# Altium schematic sheet LCD.SchDoc
size 420 x 297 mm; Address1: Address1; Address2: Address2; Address3: Address3; Address4: Address4; DocumentNumber: LCD Control FRONT 7"; SheetNumber: 1; SheetTotal: 6; Scale: 1:1; DocumentType: Схема электрическая принципиальная; FirstReferrence: АБВГ.123456.001
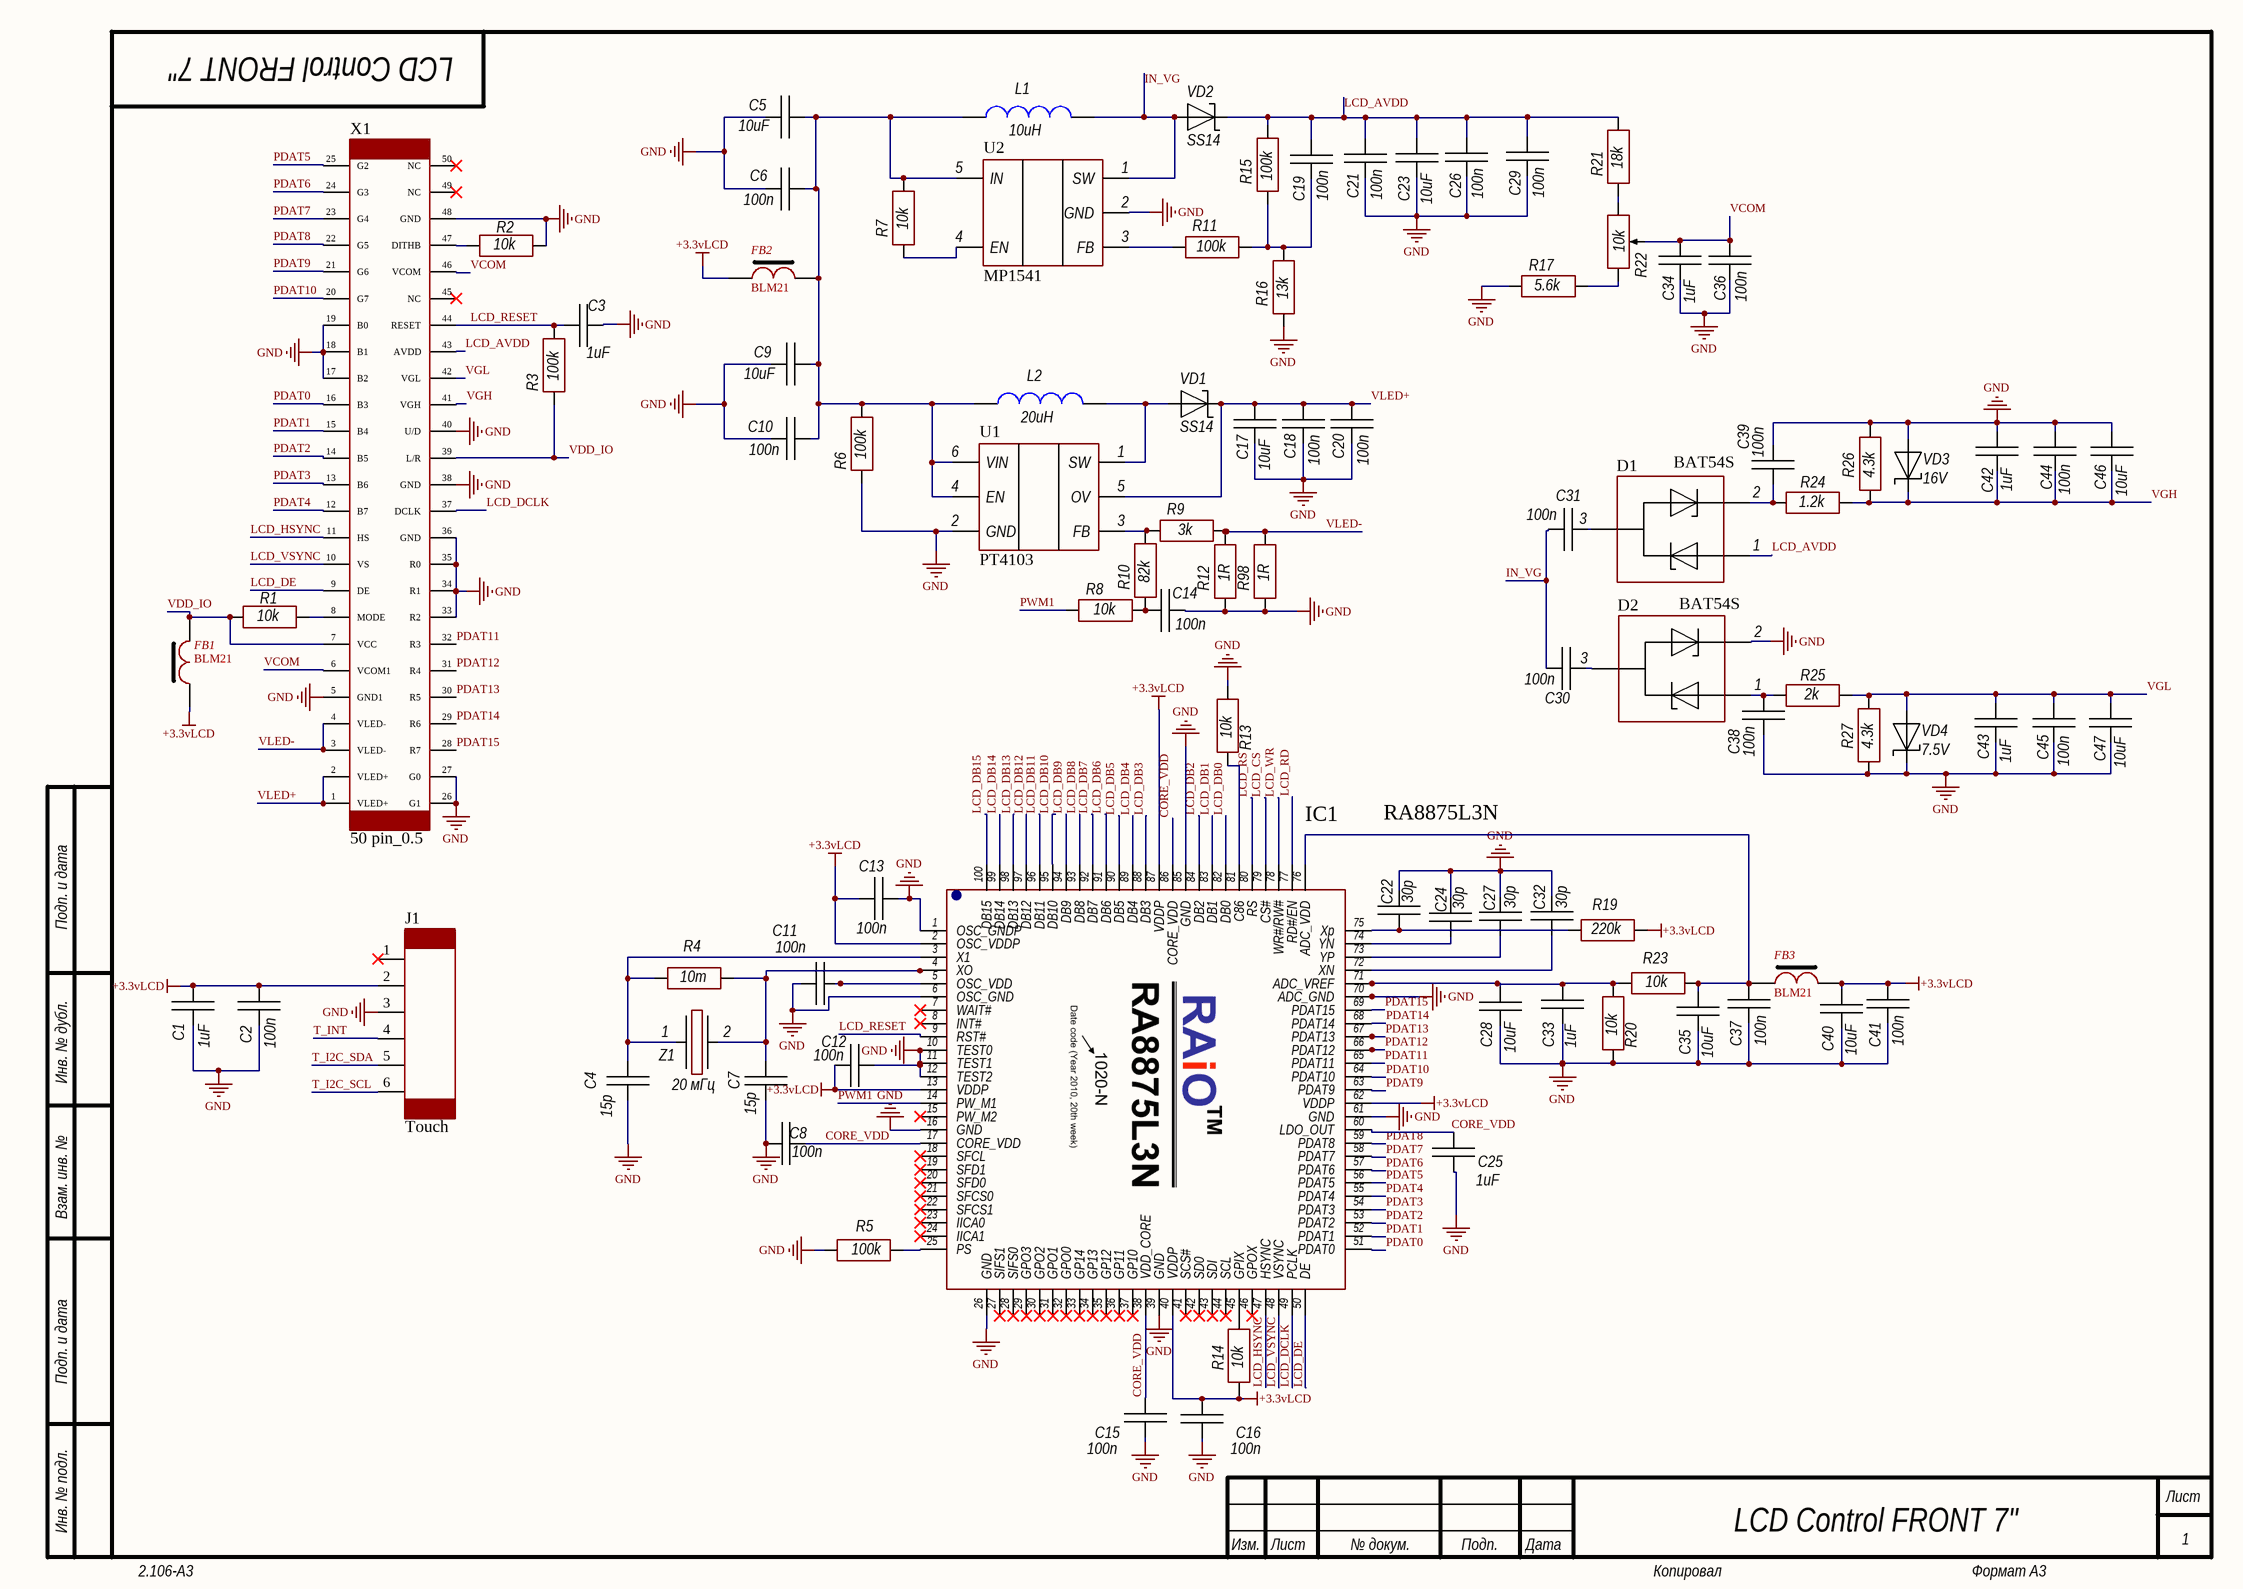
[diagram p0: LCD.SchDoc]

## Parts
C1  1uF  [CH0805C]
C2  100n  [CH0805C]
C3  1uF  [CH0603C]
C4  15p  [CH0603C]
C5  10uF  [CH1206C]
C6  100n  [CH0603C]
C7  15p  [CH0603C]
C8  100n  [CH0603C]
C9  10uF  [CH1206C]
C10  100n  [CH0603C]
C11  100n  [CH0603C]
C12  100n  [CH0603C]
C13  100n  [CH0603C]
C14  100n  [CH0603C]
C15  100n  [CH0603C]
C16  100n  [CH0603C]
C17  10uF  [CH1206C]
C18  100n  [CH0603C]
C19  100n  [CH0603C]
C20  100n  [CH0603C]
C21  100n  [CH0603C]
C22  30p  [CH0603C]
C23  10uF  [CH1206C]
C24  30p  [CH0603C]
C25  1uF  [CH0603C]
C26  100n  [CH0603C]
C27  30p  [CH0603C]
C28  10uF  [CH1206C]
C29  100n  [CH0603C]
C30  100n  [CH0603C]
C31  100n  [CH0603C]
C32  30p  [CH0603C]
C33  1uF  [CH0603C]
C34  1uF  [CH1206C]
C35  10uF  [CH1206C]
C36  100n  [CH0603C]
C37  100n  [CH0603C]
C38  100n  [CH0603C]
C39  100n  [CH0603C]
C40  10uF  [CH1206C]
C41  100n  [CH0603C]
C42  1uF  [CH0603C]
C43  1uF  [CH0603C]
C44  100n  [CH0603C]
C45  100n  [CH0603C]
C46  10uF  [CH1206C]
C47  10uF  [CH1206C]
D1  BAT54S  [SOT23_132]
D2  BAT54S  [SOT23_132]
FB1  BLM21  [CH0805L]
FB2  BLM21  [CH0805L]
FB3  BLM21  [CH0805L]
IC1  RA8875L3N  [100-LQFP]
J1  Touch  [FFC-6PIN]
L1  10uH  [IND: SDR0403]
L2  20uH  [IND: SDR0403]
R1  10k  [CH0603R]
R2  10k  [CH0603R]
R3  100k  [CH0603R]
R4  10m  [CH0603R]
R5  100k  [CH0603R]
R6  100k  [CH0603R]
R7  10k  [CH0603R]
R8  10k  [CH0603R]
R9  3k  [CH0603R]
R10  82k  [CH0603R]
R11  100k  [CH0603R]
R12  1R  [CH0603R]
R13  10k  [CH0603R]
R14  10k  [CH0603R]
R15  100k  [CH0603R]
R16  13k  [CH0603R]
R17  5.6k  [CH0603R]
R19  220k  [CH0603R]
R20  10k  [CH0603R]
R21  18k  [CH0603R]
R22  10k  [RES: 3314G]
R23  10k  [CH0603R]
R24  1.2k  [CH0603R]
R25  2k  [CH0603R]
R26  4.3k  [CH0603R]
R27  4.3k  [CH0603R]
R98  1R  [CH0603R]
U1  PT4103  [SOT23-6-ASM]
U2  MP1541  [SOT23-5]
VD1  SS14  [SMA]
VD2  SS14  [SMA]
VD3  16V  [SOD123]
VD4  7.5V  [SOD123]
X1  50 pin_0.5  [FFC FPC 50]
Z1  20 мГц  [OSC: Hz]

## Nets
+3.3vLCD: C1.2 C2.2 C12.1 C13.1 C16.2 C40.2 C41.2 FB1.2 FB2.2 FB3.1 IC1.2(OSC_VDDP) IC1.13(VDDP) IC1.40(VDDP) IC1.62(VDDP) IC1.87(VDDP) J1.2(B0) R14.1 R19.2
GND: C1.1 C2.1 C3.2 C4.1 C5.1 C6.1 C7.1 C8.1 C9.1 C10.1 C11.1 C12.2 C13.2 C14.2 C15.1 C16.1 C17.1 C18.1 C20.1 C21.1 C22.2 C23.1 C24.2 C25.1 C26.1 C27.2 C28.1 C29.1 C32.2 C33.1 C34.1 C35.1 C36.1 C37.1 C38.1 C39.2 C40.1 C41.1 C42.2 C43.1 C44.2 C45.1 C46.2 C47.1 D2.2 IC1.1(OSC_GNDP) IC1.6(OSC_GND) IC1.10(TEST0) IC1.11(TEST1) IC1.12(TEST2) IC1.16(GND) IC1.26(GND) IC1.39(GND) IC1.61(GND) IC1.70(ADC_GND) IC1.85(GND) J1.3(B1) R2.2 R5.1 R6.1 R12.1 R13.2 R16.1 R17.1 R20.1 R26.2 R27.1 R98.1 U1.2(GND) U2.2(GND) VD3.1 VD4.2 X1.5(GND1) X1.17(B2) X1.18(B1) X1.19(B0) X1.26(G1) X1.27(G0) X1.33(R2) X1.34(R1) X1.35(R0) X1.36(GND) X1.38(GND) X1.40(U/D) X1.48(GND)
CORE_VDD: C8.2 C15.2 C25.2 IC1.17(CORE_VDD) IC1.38(VDD_CORE) IC1.60(LDO_OUT) IC1.86(CORE_VDD)
IN_VG: C30.1 C31.1 L1.1 U2.1(SW) VD2.1
LCD_AVDD: C19.2 C21.2 C23.2 C26.2 C29.2 D1.1 R15.2 R21.2 VD2.2 X1.43(AVDD)
LCD_CS: IC1.79(CS#)
LCD_DB0: IC1.82(DB0)
LCD_DB1: IC1.83(DB1)
LCD_DB2: IC1.84(DB2)
LCD_DB3: IC1.88(DB3)
LCD_DB4: IC1.89(DB4)
LCD_DB5: IC1.90(DB5)
LCD_DB6: IC1.91(DB6)
LCD_DB7: IC1.92(DB7)
LCD_DB8: IC1.93(DB8)
LCD_DB9: IC1.94(DB9)
LCD_DB10: IC1.95(DB10)
LCD_DB11: IC1.96(DB11)
LCD_DB12: IC1.97(DB12)
LCD_DB13: IC1.98(DB13)
LCD_DB14: IC1.99(DB14)
LCD_DB15: IC1.100(DB15)
LCD_DCLK: IC1.49(PCLK) X1.37(DCLK)
LCD_DE: IC1.50(DE) X1.9(DE)
LCD_HSYNC: IC1.47(HSYNC) X1.11(HS)
LCD_RD: IC1.77(RD#/EN)
LCD_RESET: C3.1 IC1.9(RST#) R3.2 X1.44(RESET)
LCD_RS: IC1.80(RS)
LCD_VSYNC: IC1.48(VSYNC) X1.10(VS)
LCD_WR: IC1.78(WR#/RW#)
PDAT0: IC1.51(PDAT0) X1.16(B3)
PDAT1: IC1.52(PDAT1) X1.15(B4)
PDAT2: IC1.53(PDAT2) X1.14(B5)
PDAT3: IC1.54(PDAT3) X1.13(B6)
PDAT4: IC1.55(PDAT4) X1.12(B7)
PDAT5: IC1.56(PDAT5) X1.25(G2)
PDAT6: IC1.57(PDAT6) X1.24(G3)
PDAT7: IC1.58(PDAT7) X1.23(G4)
PDAT8: IC1.59(PDAT8) X1.22(G5)
PDAT9: IC1.63(PDAT9) X1.21(G6)
PDAT10: IC1.64(PDAT10) X1.20(G7)
PDAT11: IC1.65(PDAT11) X1.32(R3)
PDAT12: IC1.66(PDAT12) X1.31(R4)
PDAT13: IC1.67(PDAT13) X1.30(R5)
PDAT14: IC1.68(PDAT14) X1.29(R6)
PDAT15: IC1.69(PDAT15) X1.28(R7)
PWM1: IC1.14(PW_M1) R8.1
T_I2C_SCL: J1.6(B4)
T_I2C_SDA: J1.5(B3)
T_INT: J1.4(B2)
VCOM: C34.2 C36.2 R22.2 X1.6(VCOM1) X1.46(VCOM)
VDD_IO: FB1.1 R1.1 R3.1 X1.7(VCC) X1.39(L/R)
VGH: C42.1 C44.1 C46.1 R24.2 R26.1 VD3.2 X1.41(VGH)
VGL: C43.2 C45.2 C47.2 R25.2 R27.2 VD4.1 X1.42(VGL)
VLED+: C17.2 C18.2 C20.2 U1.5(OV) VD1.2 X1.1(VLED+) X1.2(VLED+)
VLED-: R9.2 R12.2 R98.2 X1.3(VLED-) X1.4(VLED-)
NetC4_2: C4.2 IC1.3(X1) R4.1 Z1.1
NetC5_2: C5.2 C6.2 C9.2 C10.2 FB2.1 L1.2 L2.2 R6.2 R7.2 U1.4(EN) U1.6(VIN) U2.5(IN)
NetC7_2: C7.2 IC1.4(XO) R4.2 Z1.2
NetC11_2: C11.2 IC1.5(OSC_VDD)
NetC14_1: C14.1 R8.2 R10.1
NetC19_1: C19.1 R11.2 R15.1 R16.2
NetC22_1: C22.1 IC1.75(Xp) R19.1
NetC24_1: C24.1 IC1.74(YN)
NetC27_1: C27.1 IC1.73(YP)
NetC28_2: C28.2 C33.2 IC1.71(ADC_VREF) R20.2 R23.1
NetC30_2: C30.2 D2.3
NetC31_2: C31.2 D1.3
NetC32_1: C32.1 IC1.72(XN)
NetC35_2: C35.2 C37.2 FB3.2 IC1.76(ADC_VDD) R23.2
NetC38_2: C38.2 D2.1 R25.1
NetC39_1: C39.1 D1.2 R24.1
NetIC1_25: IC1.25(PS) R5.2
NetIC1_45: IC1.45(GPIX) R14.2
NetIC1_81: IC1.81(C86) R13.1
NetL2_1: L2.1 U1.1(SW) VD1.1
NetR1_2: R1.2 X1.8(MODE)
NetR2_1: R2.1 X1.47(DITHB)
NetR7_1: R7.1 U2.4(EN)
NetR9_1: R9.1 R10.2 U1.3(FB)
NetR11_1: R11.1 U2.3(FB)
NetR17_2: R17.2 R22.3
NetR21_1: R21.1 R22.1

Not connected (* = marked no-connect by the designer): IC1 7(WAIT#)* 8(INT#)* 15(PW_M2)* 18(SFCL)* 19(SFD1)* 20(SFD0)* 21(SFCS0)* 22(SFCS1)* 23(IICA0)* 24(IICA1)* 27(SIFS1)* 28(SIFS0)* 29(GPO3)* 30(GPO2)* 31(GPO1)* 32(GPO0)* 33(GP14)* 34(GP13)* 35(GP12)* 36(GP11)* 37(GP10)* 41(SCS#)* 42(SD0)* 43(SDI)* 44(SCL)* 46(GPOX)*; J1 1(G7)*; X1 45(NC)* 49(NC)* 50(NC)*

## Notes on the sheet
- Подп. и дата
- Инв. № дубл.
- Взам. инв. №
- Инв. № подл.
- Изм.
- Лист
- № докум.
- Подп.
- Дата
- 2.106-A3
- Копировал
- Формат А3
- (in symbol RA8875) .

## Library data of the parts
C1-C47 = Capacitor: Manufacturer: *; Model: *; HelpURL: *; ComponentKind: *; Value: *
D1 D2 = BAT54
FB1-FB3 = FB-1
IC1 = RA8875
J1 = 6-Conn
L1 L2 = Inductor: Manufacturer: *; Model: *; HelpURL: *; ComponentKind: *; Value: *
R1-R17 R19-R21 R23-R27 R98 = Resistor: Manufacturer: *; Model: *; HelpURL: *; ComponentKind: *; Value: *
R22 = ADJ resistor: Manufacturer: *; Model: *; HelpURL: *; ComponentKind: *; Value: *
U1 = MP3202
VD1-VD4 = Diod Schottky: ComponentKind: *; Manufacturer: *; Model: *; HelpURL: *
X1 = 50-Conn
Z1 = Oscillator: Manufacturer: *; Model: *; HelpURL: *; ComponentKind: *; Value: *